# Altium schematic sheet Sheet2.SchDoc
size A4
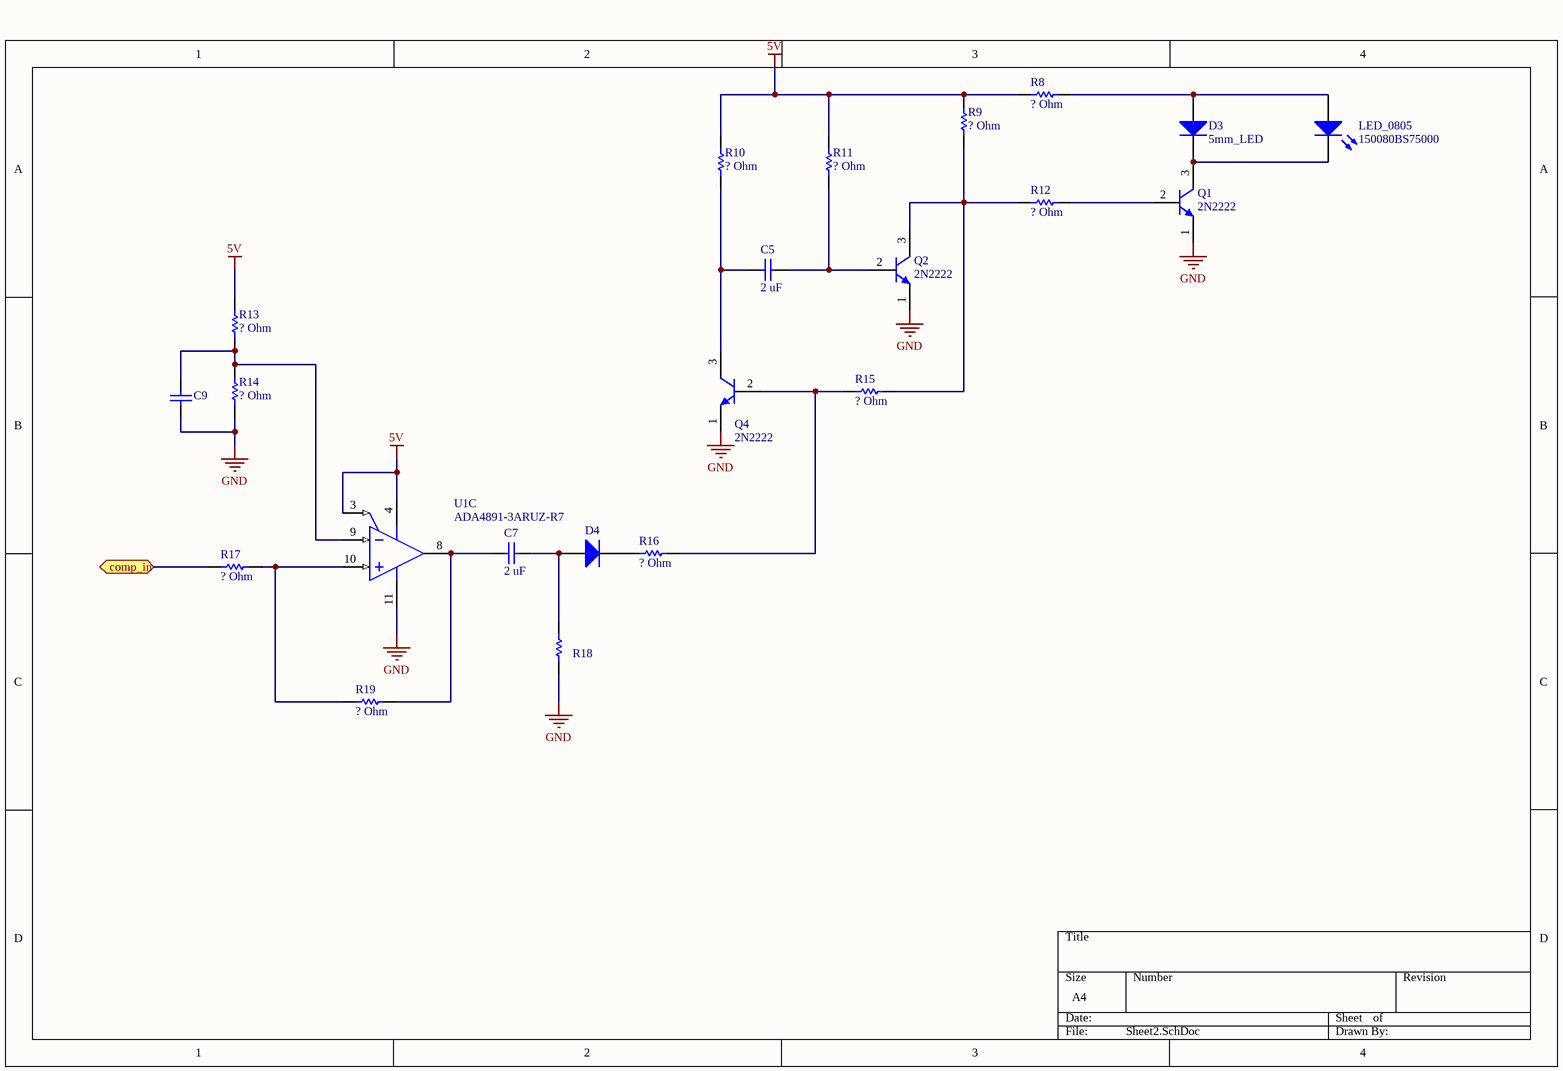
[diagram p0: Sheet2.SchDoc]

## Parts
C5  2 uF  [CAPC0805(2012)75_M]
C7  2 uF  [CAPC0805(2012)75_M]
C9  CAP 0.5pF 50V 0805(2012)  [CAPC0805(2012)75_M]  (value not drawn)
D3  5mm_LED  [3mm_diode]
D4  (no value)  [DIOD-S1M-13-F-SMA-2_V]
LED_0805  150080BS75000  [0805_A]
Q1  2N2222  [MLTC-TO-18-3]
Q2  2N2222  [MLTC-TO-18-3]
Q4  2N2222  [MLTC-TO-18-3]
R8  ? Ohm  [RESC0805(2012)_M]
R9  ? Ohm  [RESC0805(2012)_M]
R10  ? Ohm  [RESC0805(2012)_M]
R11  ? Ohm  [RESC0805(2012)_M]
R12  ? Ohm  [RESC0805(2012)_M]
R13  ? Ohm  [RESC0805(2012)_M]
R14  ? Ohm  [RESC0805(2012)_M]
R15  ? Ohm  [RESC0805(2012)_M]
R16  ? Ohm  [RESC0805(2012)_M]
R17  ? Ohm  [RESC0805(2012)_M]
R18  (no value)  [RESC0805(2012)_M]
R19  ? Ohm  [RESC0805(2012)_M]
U1  ADA4891-3ARUZ-R7  [ADI-RU-14_L]  (part C of 3)

## Ports
comp_in

## Nets
5V: R8.1 R9.1 R10.1 R11.1 R13.2 U1.3(~{PD3}) U1.4(+VS)
GND: C9.1 Q1.1(E) Q2.1(E) Q4.1(E) R14.2 R18.2 U1.11(-VS)
comp_in: R17.2 ; port comp_in
NetC5_1: C5.1 Q2.2(B) R11.2
NetC5_2: C5.2 Q4.3(C) R10.2
NetC7_1: C7.1 R19.1 U1.8(OUT_3)
NetC7_2: C7.2 D4.1(A) R18.1
NetC9_2: C9.2 R13.1 R14.1 U1.9(-IN_3)
NetD3_1: D3.1(A) LED_0805.2(A) R8.2
NetD3_2: D3.2(K) LED_0805.1(K) Q1.3(C)
NetD4_2: D4.2(K) R16.1
NetQ1_2: Q1.2(B) R12.2
NetQ2_3: Q2.3(C) R9.2 R12.1 R15.2
NetQ4_2: Q4.2(B) R15.1 R16.2
NetR17_1: R17.1 R19.2 U1.10(+IN_3)

## Library data of the parts
C5 C7 C9 = CMP-1036-00018-1: CAP 0.5pF 50V ±0.1pF 0805 (2012 Metric) Thickness 0.75mm SMD; Case-EIA: 0805; Case-Metric: 2012; Tolerance: Â±0.1pF; Value: 0.5pF; Technology: SMT; Rated Voltage: 50 V; Max Thickness: 0.75 mm
D3 = 5mm_LED: Manufacturer PN: TLHG6405
D4 = CMP-0639-00001-1: Surface Mount Glass Passivated Rectifier, 1000V, 1 A, -65 to 125 degC, 2-Pin SMA Package, RoHS, Tape and Reel; Manufacturer: Diodes Inc; PartNumber: S1M-13-F; Maximum Reverse Current IR (uA): 5; Maximum Peak Forward Surge Current IFSM (A): 30; Maximum Average Rectified Current IO (A): 1; Peak Repetitive Reverse Voltage VRRM (V): 1000; Total Capacitance CT (pF): 10; Forward Voltage Drop VF (V): 1.1; ComponentLink1URL: http://www.diodes.com/; Operating Temperature Range: -65 to 150 degC; ComponentLink3URL: http://diodes.com/datasheets/ds16003.pdf; ComponentLink3Description: Package Specification; PackageDescription: 2-Pin SMD, Body 4.3 x 2.605 mm, Height 2.3 mm; Mounting Technology: Surface Mount; ComponentLink1Description: Manufacturer URL; PackageReference: S1M-13-F-SMA-2; ComponentLink2URL: http://diodes.com/datasheets/ds16003.pdf; ComponentLink2Description: Datasheet; RoHS: TRUE; DatasheetVersion: Rev. 22 - 2; Packing: Tape and Reel; PackageVersion: Rev. 22 - 2
LED_0805 = CMP-1426-00008-1: SMD mono-color Chip LED, WL-SMCW, Blue; Manufacturer: Wuerth Elektronik; Color: Blue; ComponentLink2URL: http://katalog.we-online.com/led/datasheet/150080BS75000.pdf; ComponentLink1URL: http://www.we-online.com; ComponentLink2Description: Datasheet; PackageReference: 0805_A; ComponentLink1Description: Manufacturer URL; PartNumber: 150080BS75000
Q1 Q2 Q4 = CMP-2000-05237-1: Low Power Bipolar NPN Transistor, 30 V, -65 to 200 degC, 3-Pin TO-18, RoHS, Bulk; Manufacturer: Multicomp; Pin Configuration: a; No. of Pins: 3; No. of Transistors: 1; Collector Emitter Voltage Vces: 400mV; Current Ic Continuous a Max: 800mA; Power Dissipation Pd: 500mW; Collector Emitter Voltage V(br)ceo: 30V; Gain Bandwidth ft Typ: 250MHz; Voltage Vcbo: 60V; DC Current Gain hFE: 100; Full Power Rating Temperature: 25degC; Current Ic @ Vce Sat: 150mA; SVHC: NoSVHC(19-Dec-2012); Package Reference: TO-18-3; Package Description: 3-Pin Transistor Outline Package (TO-18), Dia 5.54 mm, Pitch Pitch 1.485mm; Datasheet URL: http://www.farnell.com/datasheets/1662272.pdf; Transistor Case Style: TO-18; Continuous Collector Current Ic Max: 800mA; Manufacturer URL: http://uk.farnell.com/b/multicomp; DC Collector Current: 800mA; Hfe Min: 100; Transistor Polarity: NPN; Power Dissipation Ptot Max: 500mW; Package / Case: TO-18; Datasheet Version: Rev. 1.1, 05/2012; Gain Bandwidth ft Min: 250MHz; Current Ic hFE: 150mA
R8-R19 = CMP-1013-00017-1: 4R3 0.125W 5% 0805 (2012 Metric)  SMD; Value: 4.30 Ohm; Case-Metric: 2012; Case-EIA: 0805; Tolerance: 5 %; Power: 0.125 W; Technology: SMT
U1 = CMP-0384-01869-1: 3 Channel Single-Supply Operation Operational Amplifier, 220 MHz BW, 170 V/us SR, Industrial, 14-pin SOP (RU-14), Reel; Manufacturer: Analog Devices; Small Signal Bandwidth: 220MHz; V Span Min: 2.7V; Iq/Amp: 4.4mA; Input Bias Current: 2pA; Amplifiers Per Package: 3; V Span Max: 5.5V; Input Offset Voltage: 2.5mV; ComponentLink2Description: Datasheet; DatasheetVersion: Rev. D; ComponentLink3Description: Package Specification; PartNumber: ADA4891-3ARUZ-R7; ComponentLink1URL: http://www.analog.com/en/index.html; ComponentLink2URL: http://www.analog.com/static/imported-files/data_sheets/ADA4891-1_4891-2_4891-3_4891-4.PDF; ComponentLink3URL: http://www.analog.com/static/imported-files/packages/36057385283879153717235186773RU14.pdf; Packing: Reel; ComponentLink1Description: Manufacturer URL; PackageDescription: 14-Pin Thin Shrink Small Outline Package, Body 5 x 4.4 mm, Pitch 0.65 mm; Generic Part Number: ADA4891-3; Mounting Technology: Surface Mount; PackageReference: RU-14; Code_JEDEC: MO-153AB-1; Slew Rate: 170V/us; PartId: 1